# EAGLE design 154N_NAU7802_TH (EAGLE 9.6.2)
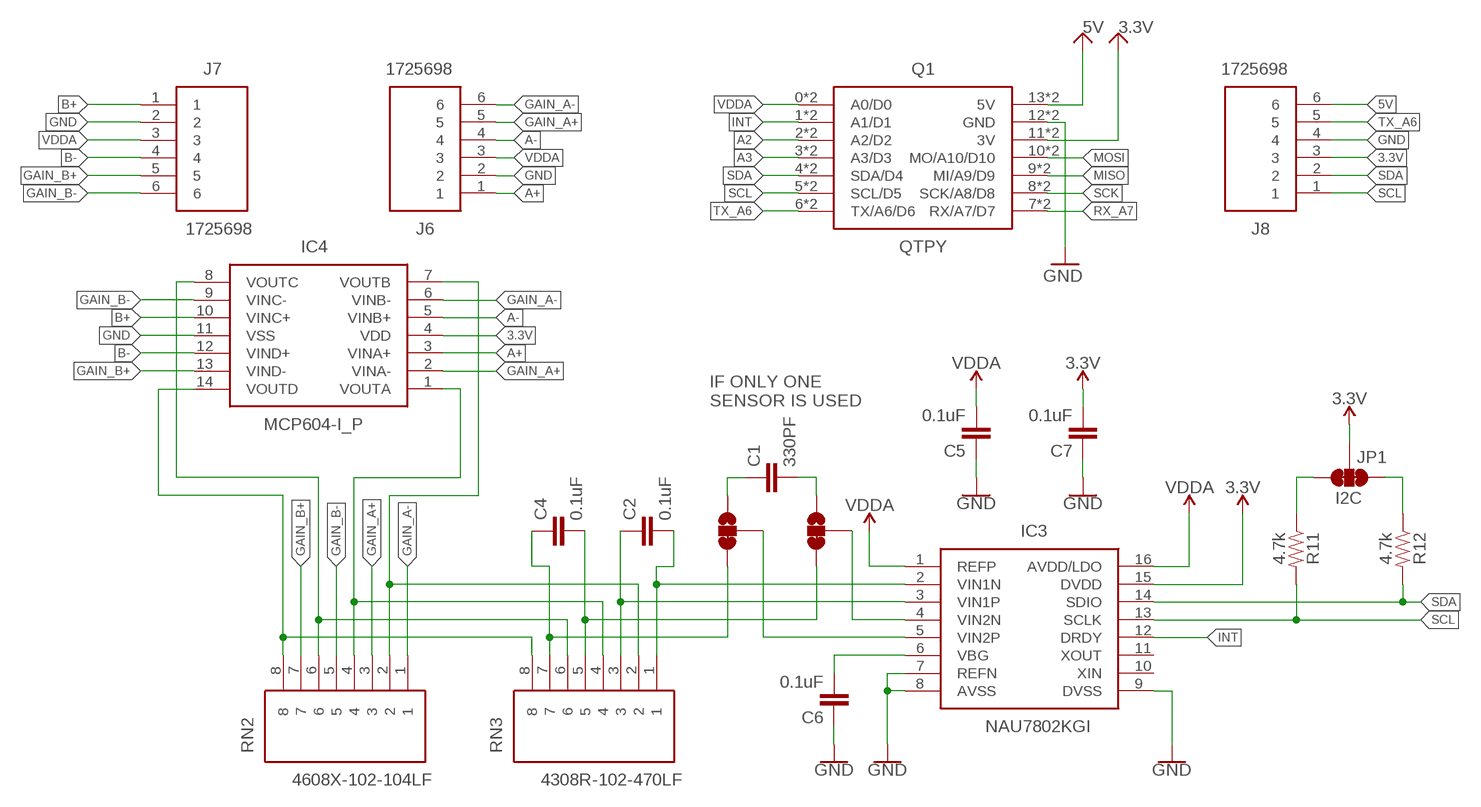
[diagram p0: schematic, sheet 1]

## Parts
C1  330PF  0.1UF-KIT-EZ-50V-20%  [CAP-PTH-SMALL-KIT]
C2  0.1uF  0.1UF-KIT-EZ-50V-20%  [CAP-PTH-SMALL-KIT]
C4  0.1uF  0.1UF-KIT-EZ-50V-20%  [CAP-PTH-SMALL-KIT]
C5  0.1uF  0.1UF-KIT-EZ-50V-20%  [CAP-PTH-SMALL-KIT]
C6  0.1uF  0.1UF-KIT-EZ-50V-20%  [CAP-PTH-SMALL-KIT]
C7  0.1uF  0.1UF-KIT-EZ-50V-20%  [CAP-PTH-SMALL-KIT]
IC3  NAU7802KGI  [DIP792W51P254L1905H53Q16N]
IC4  MCP604-I_P  [DIP781W56P254L1918H533Q14N]
J6  1725698  [SHDR6W90P0X254_1X6_1570X620X85]
J7  1725698  [SHDR6W90P0X254_1X6_1570X620X85]
J8  1725698  [SHDR6W90P0X254_1X6_1570X620X85]
JP1  I2C  JUMPER-SMT_3_2-NC_TRACE_SILK  [SMT-JUMPER_3_2-NC_TRACE_SILK]
JP4  JUMPER-SMT_3_1-NC_TRACE_NO-SILK  [SMT-JUMPER_3_1-NC_TRACE_NO-SILK]
JP5  JUMPER-SMT_3_1-NC_TRACE_NO-SILK  [SMT-JUMPER_3_1-NC_TRACE_NO-SILK]
Q1  QTPY  [QTPY]
R11  4.7k  10KOHM-HORIZ-1/4W-1%  [AXIAL-0.3]
R12  4.7k  10KOHM-HORIZ-1/4W-1%  [AXIAL-0.3]
RN2  4608X-102-104LF  [4608X102104LF]
RN3  4308R-102-470LF  [4308R102470LF]

## Nets
3.3V [3.3V]: C7.2 IC3.15(DVDD) IC4.4(VDD) J8.3 JP1.2 Q1.11(3V) Q1.11C(3V)
5V [power]: J8.6 Q1.13(5V) Q1.13C(5V) ; supply symbol labelled 3.3V
A2: Q1.2(A2/D2) Q1.2C(A2/D2)
A3: Q1.3(A3/D3) Q1.3C(A3/D3)
A+: IC4.3(VINA+) J6.1
A-: IC4.5(VINB+) J6.4
B+: IC4.10(VINC+) J7.1
B-: IC4.12(VIND+) J7.4
GAIN_A+: IC4.2(VINA-) J6.5 RN2.3
GAIN_A-: IC4.6(VINB-) J6.6 RN2.1
GAIN_B+: IC4.13(VIND-) J7.5 RN2.7
GAIN_B-: IC4.9(VINC-) J7.6 RN2.5
GND: C5.1 C6.1 C7.1 IC3.7(REFN) IC3.8(AVSS) IC3.9(DVSS) IC4.11(VSS) J6.2 J7.2 J8.4 Q1.12(GND) Q1.12C(GND)
INT: IC3.12(DRDY) Q1.1(A1/D1) Q1.1C(A1/D1)
MISO: Q1.9(MI/A9/D9) Q1.9C(MI/A9/D9)
MOSI: Q1.10(MO/A10/D10) Q1.10C(MO/A10/D10)
N$1: C1.2 JP4.1
N$2: C2.2 IC3.2(VIN1N) RN3.1
N$3: C1.1 JP5.1
N$4: IC3.4(VIN2N) JP4.2
N$5: C2.1 IC3.3(VIN1P) RN3.3
N$6: IC3.5(VIN2P) JP5.2
N$7: C4.2 JP4.3 RN3.5
N$8: C4.1 JP5.3 RN3.7
N$16: IC4.7(VOUTB) RN2.2 RN3.2
N$17: IC4.1(VOUTA) RN2.4 RN3.4
N$18: IC4.8(VOUTC) RN2.6 RN3.6
N$19: IC4.14(VOUTD) RN2.8 RN3.8
N$21: C6.2 IC3.6(VBG)
N$23: JP1.1 R12.P$1
N$26: JP1.3 R11.P$1
RX_A7: Q1.7(RX/A7/D7) Q1.7C(RX/A7/D7)
SCK: Q1.8(SCK/A8/D8) Q1.8C(SCK/A8/D8)
SCL: IC3.13(SCLK) J8.1 Q1.5(SCL/D5) Q1.5C(SCL/D5) R11.P$2
SDA: IC3.14(SDIO) J8.2 Q1.4(SDA/D4) Q1.4C(SDA/D4) R12.P$2
TX_A6: J8.5 Q1.6(TX/A6/D6) Q1.6C(TX/A6/D6)
VDDA: C5.2 IC3.1(REFP) IC3.16(AVDD/LDO) J6.3 J7.3 Q1.0(A0/D0) Q1.0C(A0/D0)
Unconnected: IC3.10(XIN) IC3.11(XOUT)

## Notes on the sheet
- IF ONLY ONE 
  SENSOR IS USED

## Library data of the parts
C1 = SparkFun-Capacitors:0.1UF: 0.1µF ceramic capacitors A capacitor is a passive two-terminal electrical component used to store electrical energy temporarily in an electric field.; PROD_ID: CAP-08370; VALUE: 0.1uF
C2 C4-C7 = SparkFun-Capacitors:0.1UF: 0.1µF ceramic capacitors A capacitor is a passive two-terminal electrical component used to store electrical energy temporarily in an electric field.; PROD_ID: CAP-08370
IC3 = NAU7802KGI:NAU7802KGI: IC ADC 24BIT I2C/SRL 16DIP Source: Datasheet <http://www.nuvoton.com/hq/resource-download.jsp?tp_GUID=DA00-NAU7802>; DESCRIPTION: IC ADC 24BIT I2C/SRL 16DIP; HEIGHT: 0.533mm; MANUFACTURER_NAME: Nuvoton; MANUFACTURER_PART_NUMBER: NAU7802KGI
IC4 = MCP604-I_P:MCP604-I_P: Microchip MCP604-I/P, Quad Op Amp, 2.8MHz CMOS, Rail to Rail, 3 V, 5 V, 14-Pin PDIP Source: Datasheet <http://uk.rs-online.com/web/p/products/3792645P>; ALLIED_NUMBER: 70045432; DESCRIPTION: Microchip MCP604-I/P, Quad Op Amp, 2.8MHz CMOS, Rail to Rail, 3 V, 5 V, 14-Pin PDIP; HEIGHT: 5.334mm; MANUFACTURER_NAME: Microchip; MANUFACTURER_PART_NUMBER: MCP604-I/P; RS_PART_NUMBER: 3792645P; RS_PRICE-STOCK: http://uk.rs-online.com/web/p/products/3792645P
J6-J8 = 1725698:1725698: 6 way PCB vertical mount terminal,2.54mm 6 way PCB vertical mount terminal,2.54mm Source: Datasheet; ALLIED_NUMBER: 70054339; DESCRIPTION: 6 way PCB vertical mount terminal,2.54mm 6 way PCB vertical mount terminal,2.54mm; HEIGHT: 8.5mm; MANUFACTURER_NAME: Phoenix Contact; MANUFACTURER_PART_NUMBER: 1725698; RS_PART_NUMBER: 3909045; RS_PRICE-STOCK: https://uk.rs-online.com/web/p/products/3909045
JP1 = SparkFun-Jumpers:JUMPER-SMT_3_2-NC_TRACE: Normally closed trace jumper (2 of 2 connections) This jumper has a trace between all three pads so they are normally closed (NC). Use a razor knife to open the connection(s). For best results follow the IPC guidelines for cutting traces: Cutout at least 0.063 mm (0.005 in). Remove all loose material to clean up the cut area. Seal the cut with an approved epoxy. Reapply solder to reclose the connection(s).
JP4 JP5 = SparkFun-Jumpers:JUMPER-SMT_3_1-NC_TRACE: Normally closed trace jumper (1 of 2 connections) This jumper has a trace between two pads so it's normally closed (NC). The other connection is normally open (NO). Use a razor knife to open the connection. For best results follow the IPC guidelines for cutting traces: Cutout at least 0.063 mm (0.005 in). Remove all loose material to clean up the cut area. Seal the cut with an approved epoxy. Reapply solder to reclose the connection, or to close the NO connection.
Q1 = 154N_NAU7802_TH:QTPY
R11 R12 = SparkFun-Resistors:10KOHM: 10kΩ resistor A resistor is a passive two-terminal electrical component that implements electrical resistance as a circuit element. Resistors act to reduce current flow, and, at the same time, act to lower voltage levels within circuits. - Wikipedia; PROD_ID: RES-12183; VALUE: 10k
RN2 = 4608X-102-104LF:4608X-102-104LF: Bourns Isolated Resistor Array 100k +/-2% 4 Resistors, 1W Total, SIP Package 4600X Through Hole Source: Datasheet <http://uk.rs-online.com/web/p/products/5223826P>; DESCRIPTION: Bourns Isolated Resistor Array 100k +/-2% 4 Resistors, 1W Total, SIP Package 4600X Through Hole; HEIGHT: 5.08mm; MANUFACTURER_NAME: Bourns; MANUFACTURER_PART_NUMBER: 4608X-102-104LF; RS_PART_NUMBER: 5223826P; RS_PRICE-STOCK: http://uk.rs-online.com/web/p/products/5223826P
RN3 = 4308R-102-470LF:4308R-102-470LF: Res Thick Film NET 47 Ohm 1 Ohm 1W +/-250ppm/C ISOL Molded 8-Pin SIP Pin Thru-Hole Source: Datasheet <https://www.arrow.com/en/products/4308r-102-470lf/bourns>; DESCRIPTION: Res Thick Film NET 47 Ohm 1 Ohm 1W +/-250ppm/C ISOL Molded 8-Pin SIP Pin Thru-Hole; HEIGHT: 4.95mm; MANUFACTURER_NAME: Bourns; MANUFACTURER_PART_NUMBER: 4308R-102-470LF

## Net classes
1 power: width 0.254 mm
2 3.3V: width 0.406 mm

## Board
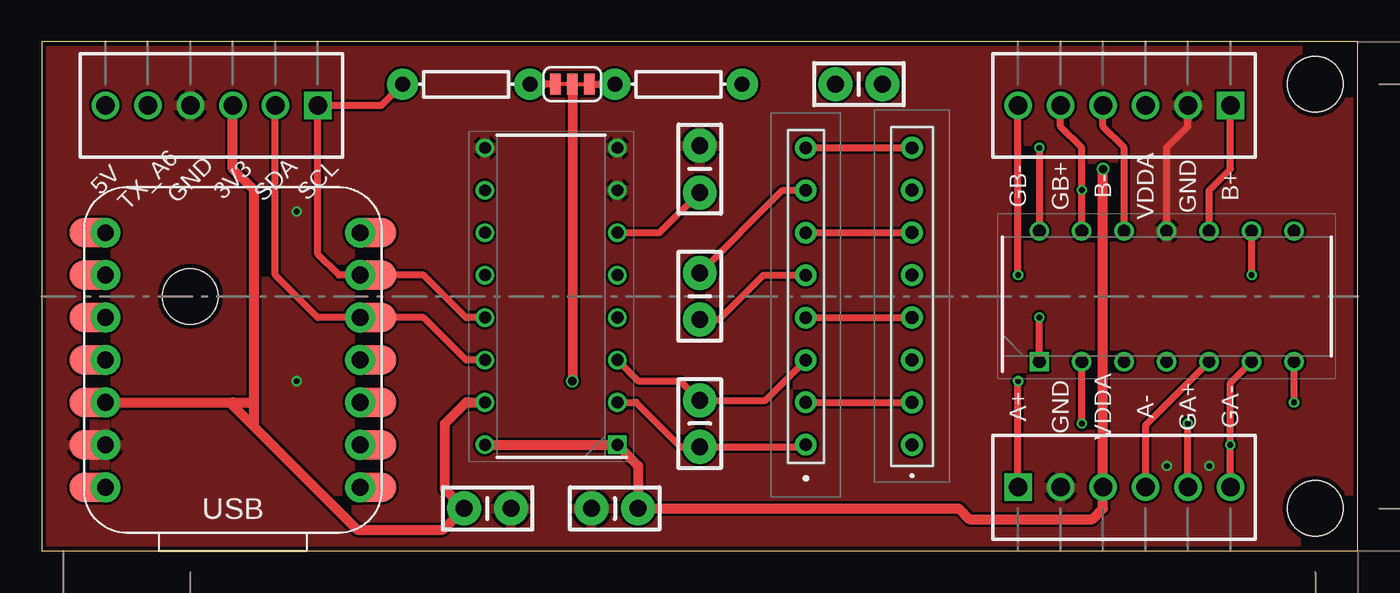
[diagram p1: board, top side]
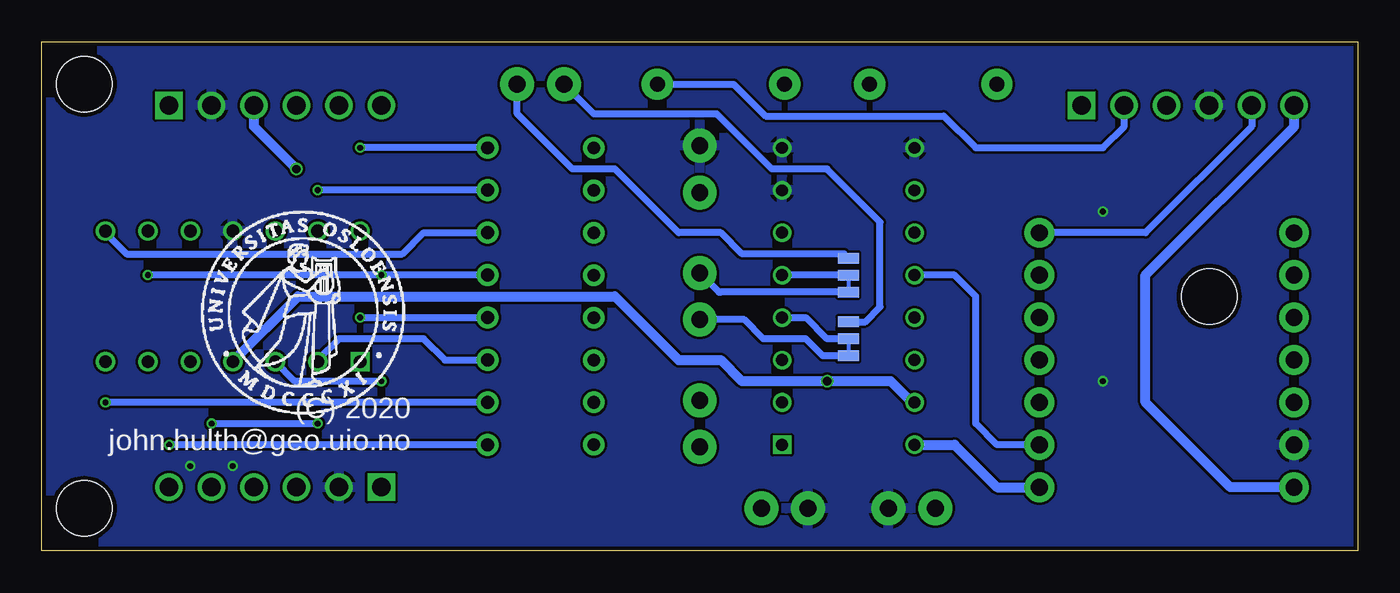
[diagram p2: board, bottom side, seen from below]

Size 78.74 x 30.48 mm. Coordinates in mm from the lower left corner, seen from the top.
Outline: 0,0 78.74,0 78.74,30.48 0,30.48 0,0
Copper layers (1*16): Top 0.018mm / dielectric 1.55mm / Bottom 0.018mm
Design rules "eC_2Layer_PClass6_BaseCopperO18_eCDefault": minimum track width 0.15mm, minimum drill 0.35mm, track to track 0.15mm, track to pad 0.15mm, pad to pad 0.15mm, via to via 0.15mm, smd to smd 0mil, copper to edge 0.25mm, drill to drill 0.35mm, minimum pad ring 0.175mm, minimum via ring 0.125mm, stop-mask expansion 0mil, vias tented up to drill 0.45mm, thermal gap 0.2mm

### Footprints (pad centres in the part's own frame; a part is rotated, then mirrored left to right if it is on the bottom)
CAP-PTH-SMALL-KIT = drill 1.016 pad 2.032: 1 -1.397,0; 2 1.397,0
DIP792W51P254L1905H53Q16N = drill 0.708 pad 1.108 square: 1 -3.962,8.89 | drill 0.708 pad 1.108: 2 -3.962,6.35; 3 -3.962,3.81; 4 -3.962,1.27; 5 -3.962,-1.27; 6 -3.962,-3.81; 7 -3.962,-6.35; 8 -3.962,-8.89; 9 3.962,-8.89; 10 3.962,-6.35; 11 3.962,-3.81; 12 3.962,-1.27; 13 3.962,1.27; 14 3.962,3.81; 15 3.962,6.35; 16 3.962,8.89
DIP781W56P254L1918H533Q14N = drill 0.759 pad 1.159 square: 1 -3.905,7.62 | drill 0.759 pad 1.159: 2 -3.905,5.08; 3 -3.905,2.54; 4 -3.905,0; 5 -3.905,-2.54; 6 -3.905,-5.08; 7 -3.905,-7.62; 8 3.905,-7.62; 9 3.905,-5.08; 10 3.905,-2.54; 11 3.905,0; 12 3.905,2.54; 13 3.905,5.08; 14 3.905,7.62
SHDR6W90P0X254_1X6_1570X620X85 = drill 1.1 pad 1.65 square: 1 0,0 | drill 1.1 pad 1.65: 2 2.54,0; 3 5.08,0; 4 7.62,0; 5 10.16,0; 6 12.7,0
SMT-JUMPER_3_2-NC_TRACE_SILK = smd 0.635 x 1.27: 1 -1.016,0; 2 0,0; 3 1.016,0
STAND-OFF = hole 3.302: 0,0
SMT-JUMPER_3_1-NC_TRACE_NO-SILK = smd 0.635 x 1.27: 1 -1.016,0; 2 0,0; 3 1.016,0
QTPY = drill 1 pad 1.778: 0 -7.62,7.62; 1 -7.62,5.08; 2 -7.62,2.54; 3 -7.62,0; 4 -7.62,-2.54; 5 -7.62,-5.08; 6 -7.62,-7.62; 7 7.62,-7.62; 8 7.62,-5.08; 9 7.62,-2.54; 10 7.62,0; 11 7.62,2.54; 12 7.62,5.08; 13 7.62,7.62 | smd 3.048 x 1.778: 0C -8.255,7.62; 1C -8.255,5.08; 2C -8.255,2.54; 3C -8.255,0; 4C -8.255,-2.54; 5C -8.255,-5.08; 6C -8.255,-7.62; 7C 8.255,-7.62; 8C 8.255,-5.08; 9C 8.255,-2.54; 10C 8.255,0; 11C 8.255,2.54; 12C 8.255,5.08; 13C 8.255,7.62
AXIAL-0.3 = drill 0.9 pad 1.88: P$1 -3.81,0; P$2 3.81,0
4608X102104LF = drill 0.77 pad 1.32: 1 0,0; 2 2.54,0; 3 5.08,0; 4 7.62,0; 5 10.16,0; 6 12.7,0; 7 15.24,0; 8 17.78,0
4308R102470LF = drill 0.75 pad 1.286: 1 0,0; 2 2.54,0; 3 5.08,0; 4 7.62,0; 5 10.16,0; 6 12.7,0; 7 15.24,0; 8 17.78,0

### Placement (x,y rotation side)
C1  48.9,27.94 180 top
C2  39.37,7.62 270 top
C4  39.37,15.24 270 top
C5  34.29,2.54 0 top
C6  39.37,22.86 270 top
C7  26.67,2.54 180 top
IC3  30.48,15.24 180 top
IC4  67.31,15.24 90 top
J6  58.42,3.81 0 top
J7  71.12,26.67 180 top
J8  16.51,26.67 180 top
JP1  31.75,27.94 180 top
JP2  STAND-OFF  [STAND-OFF]  76.2,2.54 0 top
JP3  STAND-OFF  [STAND-OFF]  76.2,27.94 0 top
JP4  30.48,12.7 270 bottom
JP5  30.48,16.51 270 bottom
JP8  STAND-OFF  [STAND-OFF]  8.89,15.24 0 top
Q1  11.43,11.43 180 top
R11  25.4,27.94 180 top
R12  38.1,27.94 0 top
RN2  52.07,6.35 90 top
RN3  45.72,6.35 90 top
U$6  [UIO-LOGO-BL]  69.43,7.93 0 bottom

### Tracks (layer width: path | path; a pad name or v marks a point on that pad's centre or on a via)
3.3V  (via drill 0.5)
  Top 0.61: IC3.15 25.4,8.89 24.13,7.62 24.13,3.68 C7.2 24,1.27 18.86,1.27 12.7,7.43 | JP1.2 v31.75,10.16 | J8.3 11.43,22.86 12.7,21.59 12.7,8.89 | Q1.11C 11.43,8.89 | 11.43,8.89 12.7,8.89 | 12.7,7.43 12.7,8.89 | 12.7,7.43 11.43,8.7 11.43,8.89
  Bottom 0.61: IC4.4 63.41,15.24 44.45,15.24 40.64,11.43 38.1,11.43 36.83,10.16 v31.75,10.16 27.94,10.16 26.67,8.89 IC3.15
5V
  Bottom 0.61: J8.6 3.81,25.4 12.7,16.51 12.7,8.89 7.62,3.81 Q1.13
A+  (via drill 0.35)
  Top 0.406: J6.1 v58.42,10.16
  Bottom 0.406: IC4.3 63.6,10.16 v58.42,10.16
A-
  Top 0.406: IC4.5 66.04,7.53 J6.4
B+
  Top 0.406: IC4.10 69.85,21.59 71.12,22.86 J7.1
B-
  Top 0.406: IC4.12 64.77,24.13 63.5,25.4 J7.4
GAIN_A+  (via drill 0.35)
  Top 0.406: J6.5 v68.58,7.62 | v62.23,7.62 IC4.2
  Bottom 0.406: v68.58,7.62 v62.23,7.62 | RN2.3 54.61,11.43 55.88,12.7 60.96,12.7 62.23,11.43 IC4.2
GAIN_A-  (via drill 0.35)
  Top 0.406: J6.6 v71.12,6.35 71.12,10.06 IC4.6
  Bottom 0.406: RN2.1 v71.12,6.35
GAIN_B+  (via drill 0.35)
  Top 0.406: IC4.13 v62.23,21.59 62.23,24.13 60.96,25.4 J7.5
  Bottom 0.406: RN2.7 v62.23,21.59
GAIN_B-  (via drill 0.35)
  Top 0.406: v58.42,16.51 J7.6 | v72.39,16.51 IC4.9
  Bottom 0.406: RN2.5 v58.42,16.51 v72.39,16.51
GND  (via drill 0.35)
  Top 0.406: J7.2 68.58,25.4 67.31,24.13 IC4.11
  other vias: 15.24,10.16 15.24,20.32 67.31,5.08 69.85,5.08
  pour Top: 0,0 0,33.02 78.74,33.02 78.74,0
  pour Bottom: 0,0 0,31.75 78.74,31.75 78.74,0
INT
  Bottom 0.406: Q1.1 21.59,6.35 22.86,7.62 22.86,15.24 24.13,16.51 IC3.12
N$1
  Bottom 0.406: JP4.1 29.46,13.72 28.57,14.61 28.57,19.68 31.75,22.86 35.05,22.86 38.35,26.16 45.72,26.16 C1.2
N$2
  Top 0.406: IC3.2 35.56,8.89 38.23,6.22 C2.2 45.59,6.22 RN3.1
N$3
  Bottom 0.406: JP5.1 30.73,17.78 36.83,17.78 38.1,19.05 40.64,19.05 44.45,22.86 46.99,22.86 50.29,26.16 C1.1
N$4
  Bottom 0.406: JP4.2 31.75,12.7 33.02,13.97 IC3.4
N$5
  Top 0.406: IC3.3 35.71,10.16 38.23,10.16 C2.1 43.31,9.02 RN3.3
N$6
  Bottom 0.406: JP5.2 IC3.5
N$7
  Top 0.406: C4.2 40.51,13.84 43.18,16.51 RN3.5
  Bottom 0.406: JP4.3 32,11.68 33.02,12.7 35.56,12.7 36.7,13.84 C4.2
N$8
  Top 0.406: C4.1 44.32,21.59 RN3.7
  Bottom 0.406: JP5.3 38.1,15.49 38.23,15.49 C4.1
N$16  (via drill 0.35)
  Top 0.406: RN3.2 RN2.2 | v74.93,8.89 IC4.7
  Bottom 0.406: RN2.2 v74.93,8.89
N$17  (via drill 0.35)
  Top 0.406: RN3.4 RN2.4 | IC4.1 v59.69,13.97
  Bottom 0.406: v59.69,13.97 RN2.4
N$18
  Top 0.406: RN3.6 RN2.6
  Bottom 0.406: IC4.8 74.93,19.05 73.66,17.78 57.15,17.78 55.88,19.05 RN2.6
N$19  (via drill 0.35)
  Top 0.406: RN3.8 RN2.8 | v59.69,24.13 IC4.14
  Bottom 0.406: RN2.8 v59.69,24.13
N$21
  Top 0.406: IC3.6 36.96,19.05 C6.2
N$23
  Top 0.406: JP1.1 R12.P$1
N$26
  Top 0.406: JP1.3 R11.P$1
SCL
  Top 0.406: R11.P$2 20.32,26.67 J8.1 16.51,17.78 17.78,16.51 Q1.5C 22.86,16.51 25.4,13.97 IC3.13
SDA
  Top 0.406: IC3.14 25.4,11.43 22.86,13.97 Q1.4C 16.51,13.97 13.97,16.51 J8.2
  Bottom 0.406: R12.P$2 37.34,27.94 35.43,26.04 24.77,26.04 22.86,24.13 15.24,24.13 13.97,25.4 J8.2
TX_A6
  Bottom 0.406: J8.5 6.35,25.4 12.7,19.05 Q1.6
VDDA  (via drill 0.5)
  Top 0.61: IC3.16 IC3.1 35.69,5.11 C5.2 54.86,2.54 55.5,1.91 62.87,1.91 63.5,2.54 J6.3 v63.5,22.86
  Bottom 0.61: v63.5,22.86 66.04,25.4 J7.3 | IC3.16 24.13,6.35 21.59,3.81 Q1.0

### Text on the board
tPlace: 5V | TX_A6 | GND | 3V3 | SDA | SCL | GB- | GB+ | B- | VDDA | GND | B+ | A+ | GND | VDDA | A- | GA+ | GA-
bPlace: (C) 2020 / john.hulth@geo.uio.no
tValues: (330pF) | 0.1uF | 0.1uF | 0.1uF | 0.1uF | 0.1uF
bValues: (One sensor capacitor)